# Altium schematic sheet VoltageIn.SchDoc
size 199 x 149 mm; SheetNumber: 2; SheetTotal: 7
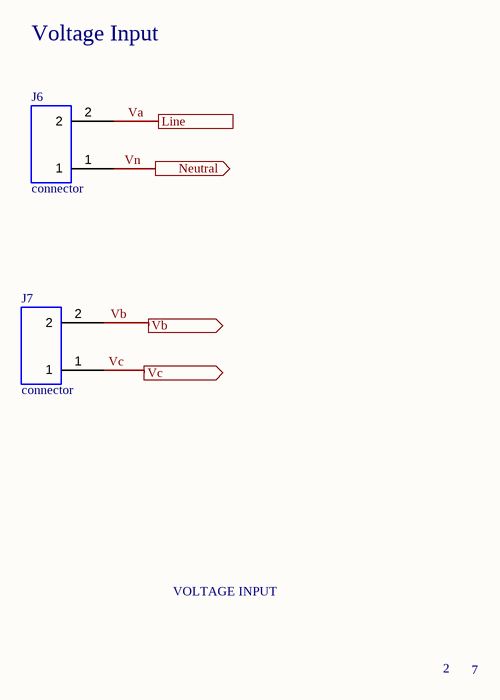
[diagram p0: VoltageIn.SchDoc]

## Parts
J6  connector  [terminal block]
J7  connector  [terminal block]

## Ports
Line (see Main[4C], PowerSupply[4C], VoltageSensorInput[7E]), Neutral (out, see Main[4C], PowerSupply[4C]), Vb (out, see Main[4C], VoltageSensorInput[7D]), Vc (out, see Main[4C], VoltageSensorInput[7B])

## Nets
Va: J6.2 ; port Line
Vb: J7.2 ; port Vb
Vc: J7.1 ; port Vc
Vn: J6.1 ; port Neutral

## Notes on the sheet
- Voltage Input
- VOLTAGE INPUT
- 2
- 7
- DWG. NO.
- REV.
- SHT.
- THIS DOCUMENT AND THE DATA DISCLOSED HEREIN OR HEREWITH IS THE PROPERTY OF ALTIUM LIMITED AND MAY BE FREELY DISTRIBUTED IN WHOLE. NO RIGHTS ARE RESERVED OR EXPRESS OR IMPLIED WARANTEE GIVEN.
- REVISION
- DESCRIPTION
- DATE
- APPROVED
- ENG:
- APPROVALS
- PROJECT
- DSN:
- CHK:
- REFERENCE DOCUMENTS
- PROJECT REVISION:
- TITLE
- DOCUMENT REVISION:
- DESIGN ITEM:
- BOM:
- FAB DWG:
- PCB DWG:
- ASSY DWG:
- SCALE:
- SIZE
- B
- CAGE CODE
- FILE NAME
- DWG NO.
- SHEET
- OF
- REV